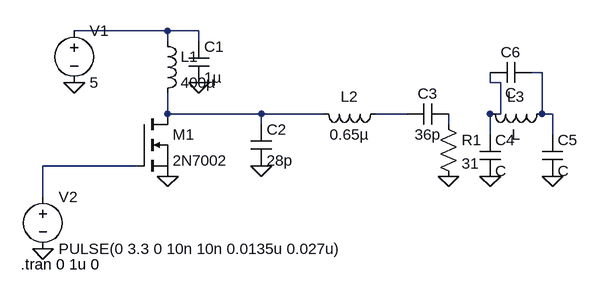
[diagram p0: schematic classe.asc]
classe.asc, the LTspice schematic file:
Version 4
SHEET 1 880 680
WIRE -544 80 -688 80
WIRE -496 80 -544 80
WIRE -544 96 -544 80
WIRE -496 96 -496 80
WIRE 32 144 16 144
WIRE -48 160 -48 144
WIRE -32 160 -48 160
WIRE -544 208 -544 176
WIRE -400 208 -544 208
WIRE -304 208 -400 208
WIRE -176 208 -224 208
WIRE -32 208 -32 160
WIRE -32 208 -48 208
WIRE 32 208 32 144
WIRE 48 208 32 208
WIRE -400 224 -400 208
WIRE -112 224 -112 208
WIRE -48 240 -48 208
WIRE 48 240 48 208
WIRE -592 288 -736 288
WIRE -736 336 -736 288
FLAG -544 304 0
FLAG -400 288 0
FLAG 48 304 0
FLAG -496 160 0
FLAG -688 160 0
FLAG -736 416 0
FLAG -112 304 0
FLAG -48 304 0
SYMBOL nmos -592 208 R0
SYMATTR InstName M1
SYMATTR Value 2N7002
SYMBOL ind -560 80 R0
SYMATTR InstName L1
SYMATTR Value 400µ
SYMBOL cap -512 96 R0
SYMATTR InstName C1
SYMATTR Value 1µ
SYMBOL cap -416 224 R0
SYMATTR InstName C2
SYMATTR Value 28p
SYMBOL cap -112 192 R90
WINDOW 0 0 32 VBottom 2
WINDOW 3 32 32 VTop 2
SYMATTR InstName C3
SYMATTR Value 36p
SYMBOL ind -208 192 R90
WINDOW 0 5 56 VBottom 2
WINDOW 3 32 56 VTop 2
SYMATTR InstName L2
SYMATTR Value 0.65µ
SYMBOL ind 48 192 R90
WINDOW 0 5 56 VBottom 2
WINDOW 3 32 56 VTop 2
SYMATTR InstName L3
SYMBOL cap 32 240 R0
SYMATTR InstName C5
SYMBOL cap 16 128 R90
WINDOW 0 0 32 VBottom 2
WINDOW 3 32 32 VTop 2
SYMATTR InstName C6
SYMBOL voltage -688 64 R0
WINDOW 123 0 0 Left 2
WINDOW 39 0 0 Left 2
SYMATTR InstName V1
SYMATTR Value 5
SYMBOL voltage -736 320 R0
WINDOW 123 0 0 Left 2
WINDOW 39 0 0 Left 2
SYMATTR InstName V2
SYMATTR Value PULSE(0 3.3 0 10n 10n 0.0135u 0.027u)
SYMBOL cap -64 240 R0
SYMATTR InstName C4
SYMBOL res -128 208 R0
SYMATTR InstName R1
SYMATTR Value 31
TEXT -770 440 Left 2 !.tran 0 1u 0

The netlist it stands for:
* classe.asc
M1 N004 N007 0 0 2N7002
L1 N001 N004 400µ
C1 N001 0 1µ
C2 N004 0 28p
C3 N006 N005 36p
L2 N005 N004 0.65µ
L3 N002 N003 L
C5 N002 0 C
C6 N002 N003 C
V1 N001 0 5
V2 N007 0 PULSE(0 3.3 0 10n 10n 0.0135u 0.027u)
C4 N003 0 C
R1 N006 0 31
.model NMOS NMOS
.model PMOS PMOS
.lib standard.mos
.tran 0 1u 0
.backanno
.end